# Altium project BY-IOM-v0.2.PrjPCB
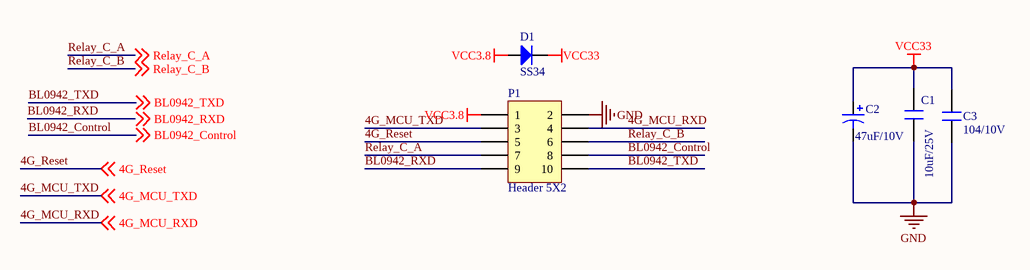
[diagram p0: 连接.SchDoc]
3 sheets, 42 parts. Net scope: global (net labels, ports and power ports of the same name join across sheets).
Board file: Power.PcbDoc
Sheets:
  连接.SchDoc
  MCU.SchDoc
  显示.SchDoc

## Sheet 连接.SchDoc
size A4

### Parts
C1  10uF/25V  [0603R]
C2  47uF/10V  [0805R]
C3  104/10V  [0603R]
D1  SS34  [DO-214AC]
P1  Header 5X2  [HDR2X5]

### Nets
GND: C1.1 C2.2 C3.1 P1.2
VCC3.8: D1.2(A) P1.1
VCC33: C1.2 C2.1 C3.2 D1.1(K)
4G_MCU_RXD: P1.4 ; off-sheet 4G_MCU_RXD
4G_MCU_TXD: P1.3 ; off-sheet 4G_MCU_TXD
4G_Reset: P1.5 ; off-sheet 4G_Reset
BL0942_Control: P1.8 ; off-sheet BL0942_Control
BL0942_RXD: P1.9 ; off-sheet BL0942_RXD
BL0942_TXD: P1.10 ; off-sheet BL0942_TXD
Relay_C_A: P1.7 ; off-sheet Relay_C_A
Relay_C_B: P1.6 ; off-sheet Relay_C_B

### Notes on the sheet
- Labels drawn without touching a wire or pin: BL0942_RXD

### Library data of the parts
C1 = CAP
C2 = Cap Pol1: Polarized Capacitor (Radial); Published: 8-Jun-2000; LatestRevisionDate: 17-Jul-2002; LatestRevisionNote: Re-released for DXP Platform.; PackageReference: RB7.6-15; Publisher: Altium Limited; PackageDescription: Polarized Capacitor (Radial); 2 Leads
C3 = CAP_1
D1 = DIODE
P1 = Header 5X2: Header, 5-Pin, Dual row; LatestRevisionDate: 17-Jul-2002; LatestRevisionNote: Re-released for DXP Platform.; Publisher: Altium Limited

## Sheet MCU.SchDoc
size A4
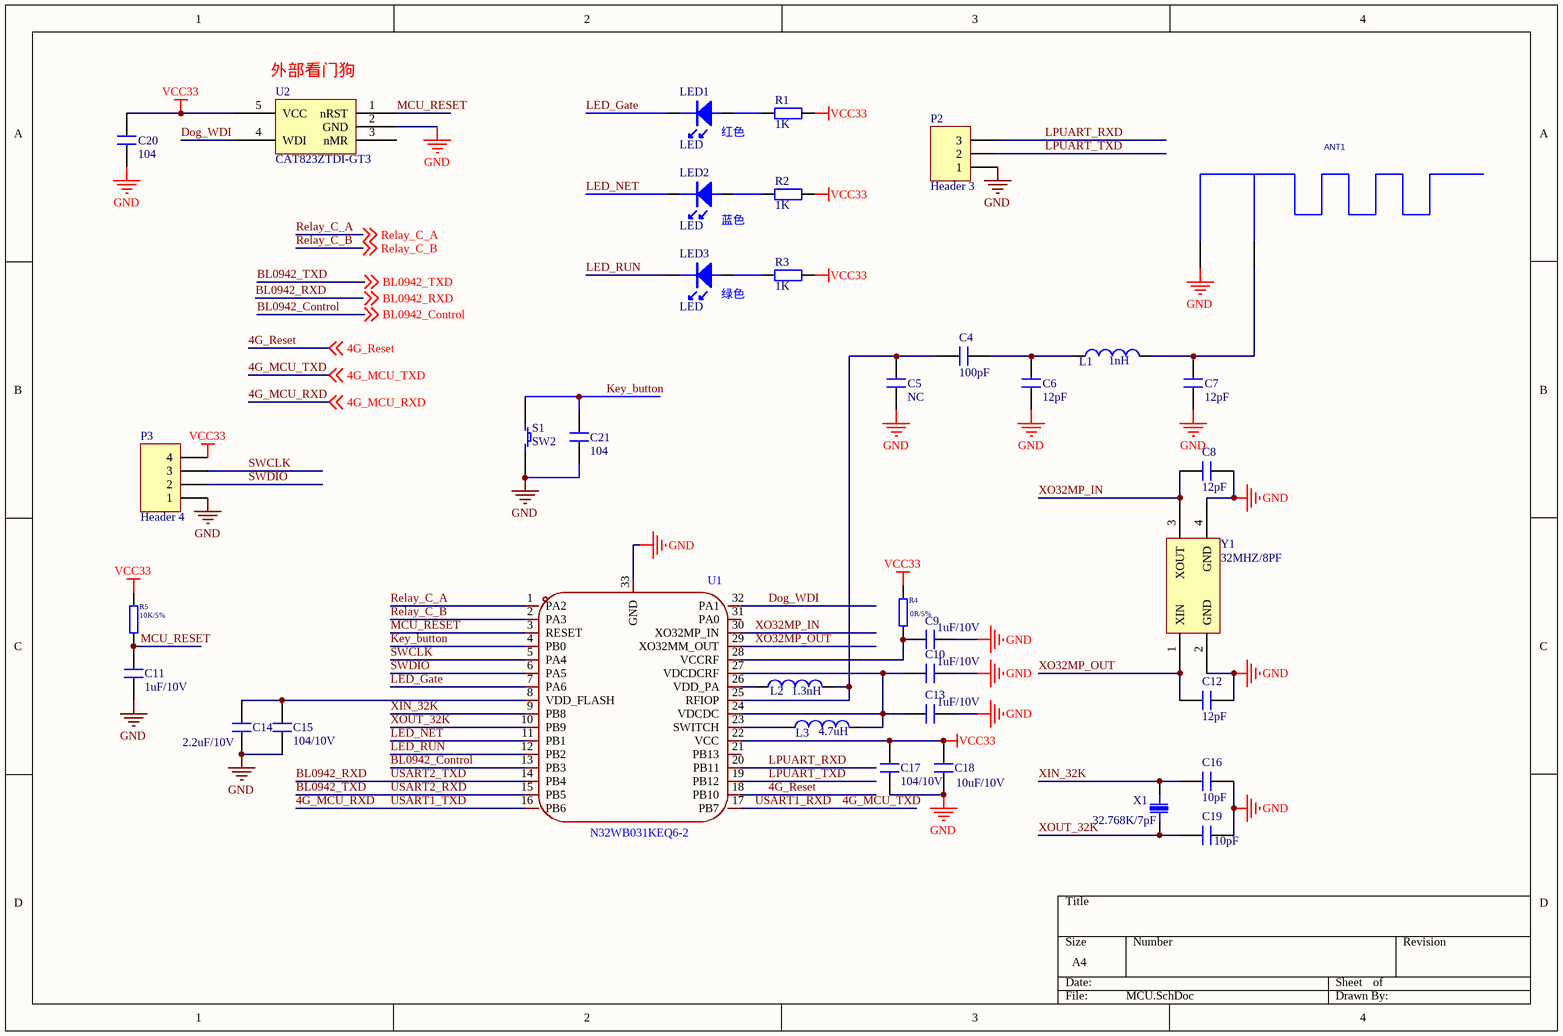
[diagram p1: MCU.SchDoc]

### Parts
ANT1  ANT_2.4G  [ANTENNA_IIFA_BLE_MIRROR]  (value not drawn)
C4  100pF  [0603R]
C5  NC  [0603R]
C6  12pF  [0603R]
C7  12pF  [0603R]
C8  12pF  [0603r]
C9  1uF/10V  [0603R]
C10  1uF/10V  [0603R]
C11  1uF/10V  [0603R]
C12  12pF  [0603r]
C13  1uF/10V  [0603R]
C14  2.2uF/10V  [0603R]
C15  104/10V  [0603R]
C16  10pF  [0603r]
C17  104/10V  [0603R]
C18  10uF/10V  [0603R]
C19  10pF  [0603r]
C20  104  [0603R]
C21  104  [0603R]
L1  1nH  [贴片电感5020]
L2  1.3nH  [贴片电感5020]
L3  4.7uH  [贴片电感5020]
LED1  LED  [LED0805]
LED2  LED  [LED0805]
LED3  LED  [LED0805]
P2  Header 3  [HDR1X3]
P3  Header 4  [HDR1X4]
R1  value 1K  [0603R]  (hidden comment: Res2)
R2  value 1K  [0603R]  (hidden comment: Res2)
R3  value 1K  [0603R]  (hidden comment: Res2)
R4  0R/5%  [0603R]
R5  10K/5%  [0603R]
S1  SW2  [4.5*4.5贴片4脚独立按键]
U1  N32WB031KEQ6-2  [QFN-32_L4.0-W4.0-P0.40-TL-EP2.8]
U2  CAT823ZTDI-GT3  [SOT-23-5]
X1  32.768K/7pF  [Y3215]
Y1  32MHZ/8PF  [3225]

### Nets
GND: ANT1.2 C5.2 C6.1 C7.1 C8.1 C9.1 C10.1 C11.1 C12.1 C13.1 C14.1 C15.1 C16.2 C17.1 C18.1 C19.1 C20.1 C21.2 P2.1 P3.1 S1.2 U1.33(GND) U2.2(GND) Y1.2(GND) Y1.4(GND)
VCC33: C17.2 C18.2 C20.2 P3.4 R1.1 R2.1 R3.1 R4.1 R5.1 U1.22(VCC) U2.5(VCC)
4G_MCU_RXD: U1.16(PB6) ; off-sheet 4G_MCU_RXD  [also labelled USART1_TXD]
4G_MCU_TXD: U1.17(PB7) ; off-sheet 4G_MCU_TXD  [also labelled USART1_RXD]
4G_Reset: U1.18(PB10) ; off-sheet 4G_Reset
BL0942_Control: U1.13(PB3) ; off-sheet BL0942_Control
BL0942_RXD: U1.14(PB4) ; off-sheet BL0942_RXD  [also labelled USART2_TXD]
BL0942_TXD: U1.15(PB5) ; off-sheet BL0942_TXD  [also labelled USART2_RXD]
Dog_WDI: U1.32(PA1) U2.4(WDI)
Key_button: C21.1 S1.1 U1.4(PB0)
LED_Gate: LED1.2 U1.7(PA6)
LED_NET: LED2.2 U1.11(PB1)
LED_RUN: LED3.2 U1.12(PB2)
LPUART_RXD: P2.3 U1.20(PB11)
LPUART_TXD: P2.2 U1.19(PB12)
MCU_RESET: C11.2 R5.2 U1.3(RESET) U2.1(nRST)
Relay_C_A: U1.1(PA2) ; off-sheet Relay_C_A
Relay_C_B: U1.2(PA3) ; off-sheet Relay_C_B
SWCLK: P3.3 U1.5(PA4)
SWDIO: P3.2 U1.6(PA5)
XIN_32K: C16.1 U1.9(PB8) X1.2
XO32MP_IN: C8.2 U1.30(XO32MP_IN) Y1.3(XOUT)
XO32MP_OUT: C12.2 U1.29(XO32MM_OUT) Y1.1(XIN)
XOUT_32K: C19.2 U1.10(PB9) X1.1
NetANT1_1: ANT1.1 C7.2 L1.2
NetC4_1: C4.1 C5.1 L2.2 U1.25(RFIOP)
NetC4_2: C4.2 C6.2 L1.1
NetC9_2: C9.2 R4.2 U1.28(VCCRF)
NetC10_2: C10.2 C13.2 L3.2 U1.24(VDCDC) U1.27(VDCDCRF)
NetC14_2: C14.2 C15.2 U1.8(VDD_FLASH)
NetL2_1: L2.1 U1.26(VDD_PA)
NetL3_1: L3.1 U1.23(SWITCH)
NetLED1_1: LED1.1 R1.2
NetLED2_1: LED2.1 R2.2
NetLED3_1: LED3.1 R3.2

Not connected (* = marked no-connect by the designer): U1 21(PB13) 31(PA0); U2 3(nMR)

### Notes on the sheet
- (near U2) 外部看门狗
- (near LED1) 红色
- (near LED2) 蓝色
- (near LED3) 绿色
- Labels drawn without touching a wire or pin: BL0942_RXD

### Library data of the parts
ANT1 = ANT_2.4G: 连接器，4PIN，2.0mm脚间距离，防呆直插件; Geometry.Height: 6.00000mm; Value: NC/4X2.0MM; PCB DECAL: ANTENNA_IIFA_BLE_MIRROR
C4-C7 C9-C11 C13-C15 C17 C18 = CAP_1
C8 C12 C16 C19-C21 = CAP
L1-L3 = Inductor: Code_IEC: 1005; Published: 8-Jun-2000; LatestRevisionDate: 29-May-2009; LatestRevisionNote: IPC-7351 Footprint Added.; PackageReference: 0402-A; Publisher: Altium Limited; PackageDescription: Chip Inductor; Code_JEITA: 0402
P2 = Header 3: Header, 3-Pin; LatestRevisionDate: 17-Jul-2002; LatestRevisionNote: Re-released for DXP Platform.; Publisher: Altium Limited
P3 = Header 4: Header, 4-Pin; LatestRevisionDate: 17-Jul-2002; LatestRevisionNote: Re-released for DXP Platform.; Publisher: Altium Limited
R4 R5 = RES
U1 = N32WB031KEQ6-2: Manufacturer: Nations(国民技术); Add into BOM: yes; Symbol: N32WB031KEQ6-2; Device: N32WB031KEQ6-2; LCSC Part Name: N32WB031KEQ6-2; Supplier Part: C2981446; Manufacturer Part: N32WB031KEQ6-2; Supplier Footprint: QFN-32; JLCPCB Part Class: Extended Part; Supplier: LCSC; Convert to PCB: yes
U2 = CAT823
X1 = XTAL
Y1 = 12MHz无源
R1-R3 = Res2: Published: 8-Jun-2000; LatestRevisionDate: 17-Jul-2002; LatestRevisionNote: Re-released for DXP Platform.; PackageReference: AXIAL-0.4; Publisher: Altium Limited; PackageDescription: Axial Device, Thru-Hole; 2 Leads; 0.4 in Pin Spacing

## Sheet 显示.SchDoc
size A4

## Nets that join several sheets
GND: 连接 (C1.1 C2.2 C3.1 P1.2), MCU (25 pins)
VCC33: 连接 (C1.2 C2.1 C3.2 D1.1), MCU (11 pins)
4G_MCU_RXD: 连接 (P1.4), MCU (U1.16)
4G_MCU_TXD: 连接 (P1.3), MCU (U1.17)
4G_Reset: 连接 (P1.5), MCU (U1.18)
BL0942_Control: 连接 (P1.8), MCU (U1.13)
BL0942_RXD: 连接 (P1.9), MCU (U1.14)
BL0942_TXD: 连接 (P1.10), MCU (U1.15)
Relay_C_A: 连接 (P1.7), MCU (U1.1)
Relay_C_B: 连接 (P1.6), MCU (U1.2)